# Altium schematic sheet FlashBoard.SchDoc
size 431 x 279 mm; SheetNumber: 1; SheetTotal: 1; ENG_APP_DATE: --/--/--; DSN_APP_DATE: --/--/--; CHK_APP_DATE: --/--/--
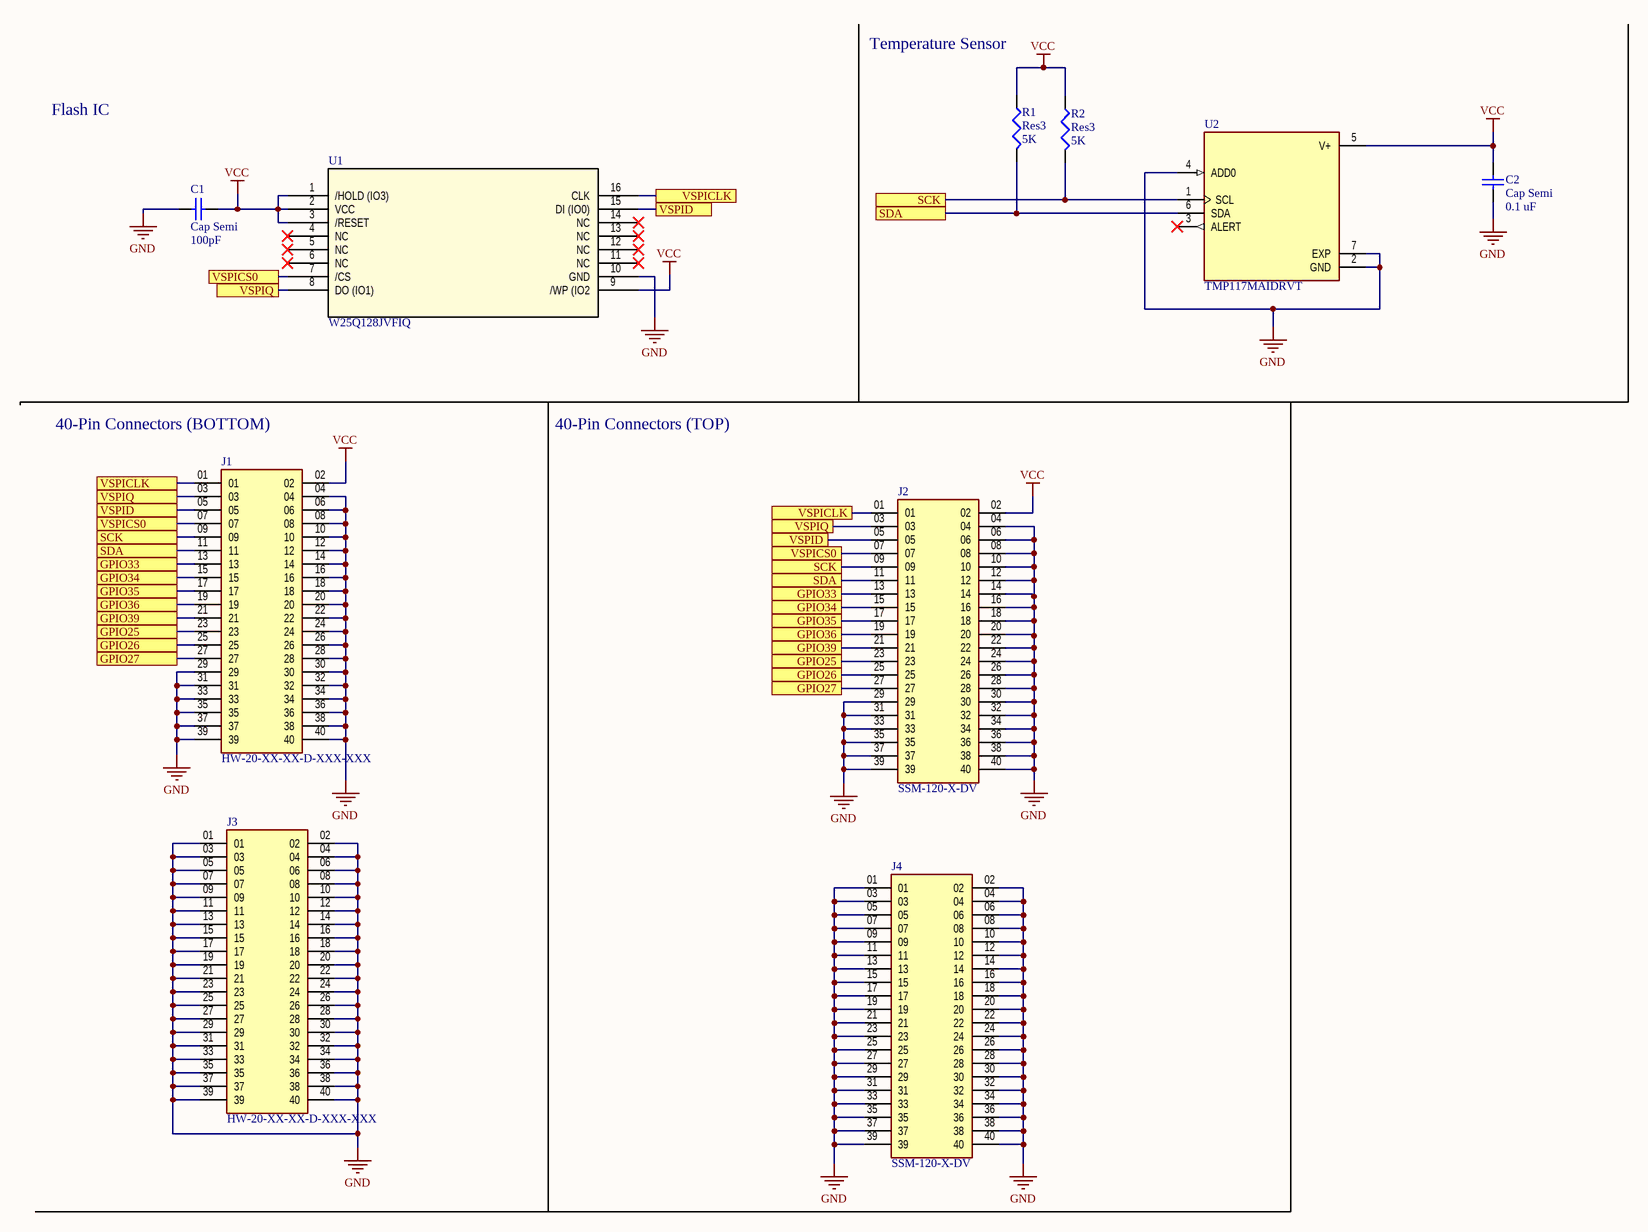
[diagram p0: FlashBoard.SchDoc]

## Parts
C1  Cap Semi  value 100pF  [C1206]
C2  Cap Semi  value 0.1 uF  [C1206]
J1  HW-20-XX-XX-D-XXX-XXX  [SAMTEC_HW-20-16-F-D-250-SM]
J2  SSM-120-X-DV  [SAMTEC_SSM-120-X-DV]
J3  HW-20-XX-XX-D-XXX-XXX  [SAMTEC_HW-20-16-F-D-250-SM]
J4  SSM-120-X-DV  [SAMTEC_SSM-120-X-DV]
R1  Res3  value 5K  [J1-0603]
R2  Res3  value 5K  [J1-0603]
U1  W25Q128JVFIQ  [SOIC_28JVFIQ_WIN]
U2  TMP117MAIDRVT  [SON65P200X200X80-7N]

## Ports
GPIO25, GPIO26, GPIO27, GPIO33, GPIO34, GPIO35, GPIO36, GPIO39, SCK, SDA, VSPICLK, VSPICS0, VSPID, VSPIQ

## Nets
GND: C1.1 C2.2 J1.04 J1.06 J1.08 J1.10 J1.12 J1.14 J1.16 J1.18 J1.20 J1.22 J1.24 J1.26 J1.28 J1.29 J1.30 J1.31 J1.32 J1.33 J1.34 J1.35 J1.36 J1.37 J1.38 J1.39 J1.40 J2.04 J2.06 J2.08 J2.10 J2.12 J2.14 J2.16 J2.18 J2.20 J2.22 J2.24 J2.26 J2.28 J2.29 J2.30 J2.31 J2.32 J2.33 J2.34 J2.35 J2.36 J2.37 J2.38 J2.39 J2.40 J3.01 J3.02 J3.03 J3.04 J3.05 J3.06 J3.07 J3.08 J3.09 J3.10 J3.11 J3.12 J3.13 J3.14 J3.15 J3.16 J3.17 J3.18 J3.19 J3.20 J3.21 J3.22 J3.23 J3.24 J3.25 J3.26 J3.27 J3.28 J3.29 J3.30 J3.31 J3.32 J3.33 J3.34 J3.35 J3.36 J3.37 J3.38 J3.39 J3.40 J4.01 J4.02 J4.03 J4.04 J4.05 J4.06 J4.07 J4.08 J4.09 J4.10 J4.11 J4.12 J4.13 J4.14 J4.15 J4.16 J4.17 J4.18 J4.19 J4.20 J4.21 J4.22 J4.23 J4.24 J4.25 J4.26 J4.27 J4.28 J4.29 J4.30 J4.31 J4.32 J4.33 J4.34 J4.35 J4.36 J4.37 J4.38 J4.39 J4.40 U1.10(GND) U2.2(GND) U2.4(ADD0) U2.7(EXP)
VCC: C1.2 C2.1 J1.02 J2.02 R1.1 R2.1 U1.1(/HOLD_(IO3)) U1.2(VCC) U1.3(/RESET) U1.9(/WP_(IO2) U2.5(V+)
GPIO25: J1.23 J2.23 ; port GPIO25
GPIO26: J1.25 J2.25 ; port GPIO26
GPIO27: J1.27 J2.27 ; port GPIO27
GPIO33: J1.13 J2.13 ; port GPIO33
GPIO34: J1.15 J2.15 ; port GPIO34
GPIO35: J1.17 J2.17 ; port GPIO35
GPIO36: J1.19 J2.19 ; port GPIO36
GPIO39: J1.21 J2.21 ; port GPIO39
SCK: J1.09 J2.09 R2.2 U2.1(SCL) ; port SCK
SDA: J1.11 J2.11 R1.2 U2.6(SDA) ; port SDA
VSPICLK: J1.01 J2.01 U1.16(CLK) ; port VSPICLK
VSPICS0: J1.07 J2.07 U1.7(/CS) ; port VSPICS0
VSPID: J1.05 J2.05 U1.15(DI_(IO0)) ; port VSPID
VSPIQ: J1.03 J2.03 U1.8(DO_(IO1)) ; port VSPIQ

Not connected (* = marked no-connect by the designer): U1 4(NC)* 5(NC)* 6(NC)* 11(NC)* 12(NC)* 13(NC)* 14(NC)*; U2 3(ALERT)*

## Notes on the sheet
- Temperature Sensor
- Flash IC
- (near J1) 40-Pin Connectors (BOTTOM)
- 40-Pin Connectors (TOP)
- 8
- 7
- 6
- 5
- 4
- 3
- DWG. NO.
- REV.
- SHT.
- 2
- 1
- THIS DOCUMENT AND THE DATA DISCLOSED HEREIN OR HEREWITH IS THE PROPERTY OF ALTIUM LIMITED AND MAY BE FREELY DISTRIBUTED IN WHOLE. NO RIGHTS ARE RESERVED OR EXPRESS OR IMPLIED WARANTEE GIVEN.
- REVISION
- DESCRIPTION
- DATE
- APPROVED
- F
- E
- D
- C
- B
- ENG:
- APPROVALS
- PROJECT
- SUITE 200
- 2175 SALK AVENUE
- CARLSBAD, CA 92008
- A
- DSN:
- CHK:
- REFERENCE DOCUMENTS
- PROJECT REVISION:
- TITLE
- DOCUMENT REVISION:
- DESIGN ITEM:
- USA
- BOM:
- FAB DWG:
- PCB DWG:
- ASSY DWG:
- SCALE:
- SIZE
- CAGE CODE
- FILE NAME
- DWG NO.
- SHEET
- OF
- REV

## Library data of the parts
C1 C2 = Cap Semi: Capacitor (Semiconductor SIM Model); Published: 8-Jun-2000; LatestRevisionDate: 29-May-2009; LatestRevisionNote: IPC-7351 Footprint Added.; PackageReference: C1206; Publisher: Altium Limited; PackageDescription: Chip Capacitor
J1 J3 = HW-20-XX-XX-D-XXX-XXX: MF: Samtec; MP: HW-20-08-G-D-350-100; Check_prices: https://www.snapeda.com/parts/HW-20-08-G-D-350-100/Samtec/view-part/?ref=eda; Value: *; Availability: Not in stock; Price: None; Package: None; SnapEDA_Link: https://www.snapeda.com/parts/HW-20-08-G-D-350-100/Samtec/view-part/?ref=snap
J2 J4 = SSM-120-X-DV: MF: Samtec; Availability: Unavailable; MP: SSM-120-X-DV; Price: None; Value: *; Package: None
R1 R2 = Res3: Resistor; Published: 8-Jun-2000; LatestRevisionDate: 29-May-2009; LatestRevisionNote: IPC-7351 Footprint Added.; PackageReference: J1-0603; Publisher: Altium Limited; PackageDescription: Chip Resistor
U1 = W25Q128JVFIQ: No Description Available; Mfr_Name: Winbond; Copyright: Copyright (C) 2022 Ultra Librarian. All rights reserved.; Manufacturer_Part_Number: W25Q128JVFIQ; Digi-Key_Part_Number_1: W25Q128JVFIQ-ND; RefDes: RefDes; Type: DEV
U2 = TMP117MAIDRVT: 0.1C accurate digital temperature sensor with integrated NV memory 6-WSON 0 to 85; MF: Texas Instruments; Value: *; Purchase-URL: https://pricing.snapeda.com/search/part/TMP117MAIDRVT/?ref=eda; MP: TMP117MAIDRVT; Digi-Key_Part_Number: 296-52215-1-ND; Check_prices: https://www.snapeda.com/parts/TMP117MAIDRVT/Texas+Instruments/view-part/?ref=eda; SnapEDA_Link: https://www.snapeda.com/parts/TMP117MAIDRVT/Texas+Instruments/view-part/?ref=snap; Package: WSON-6 Texas Instruments